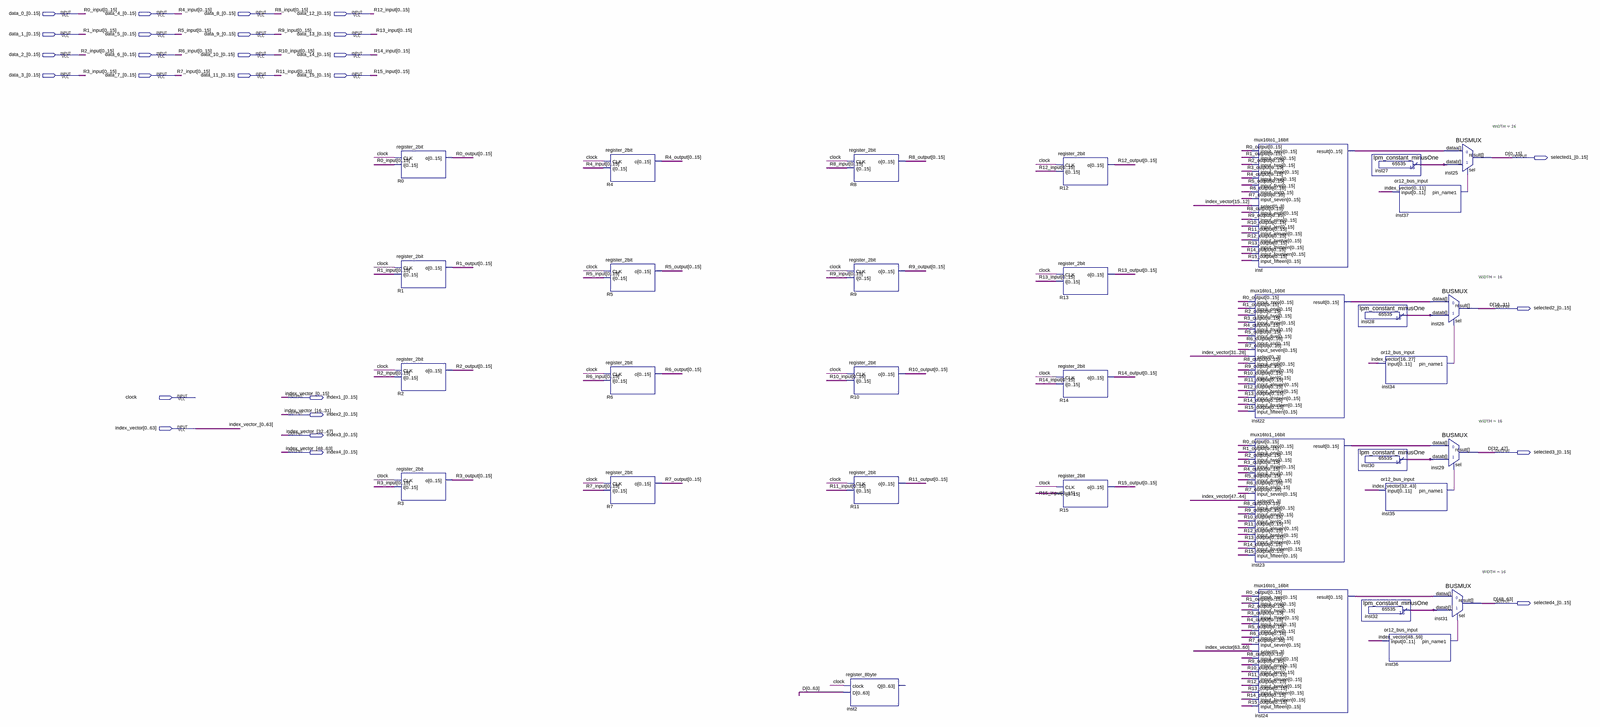
[diagram p0: schematic sheet, whole]
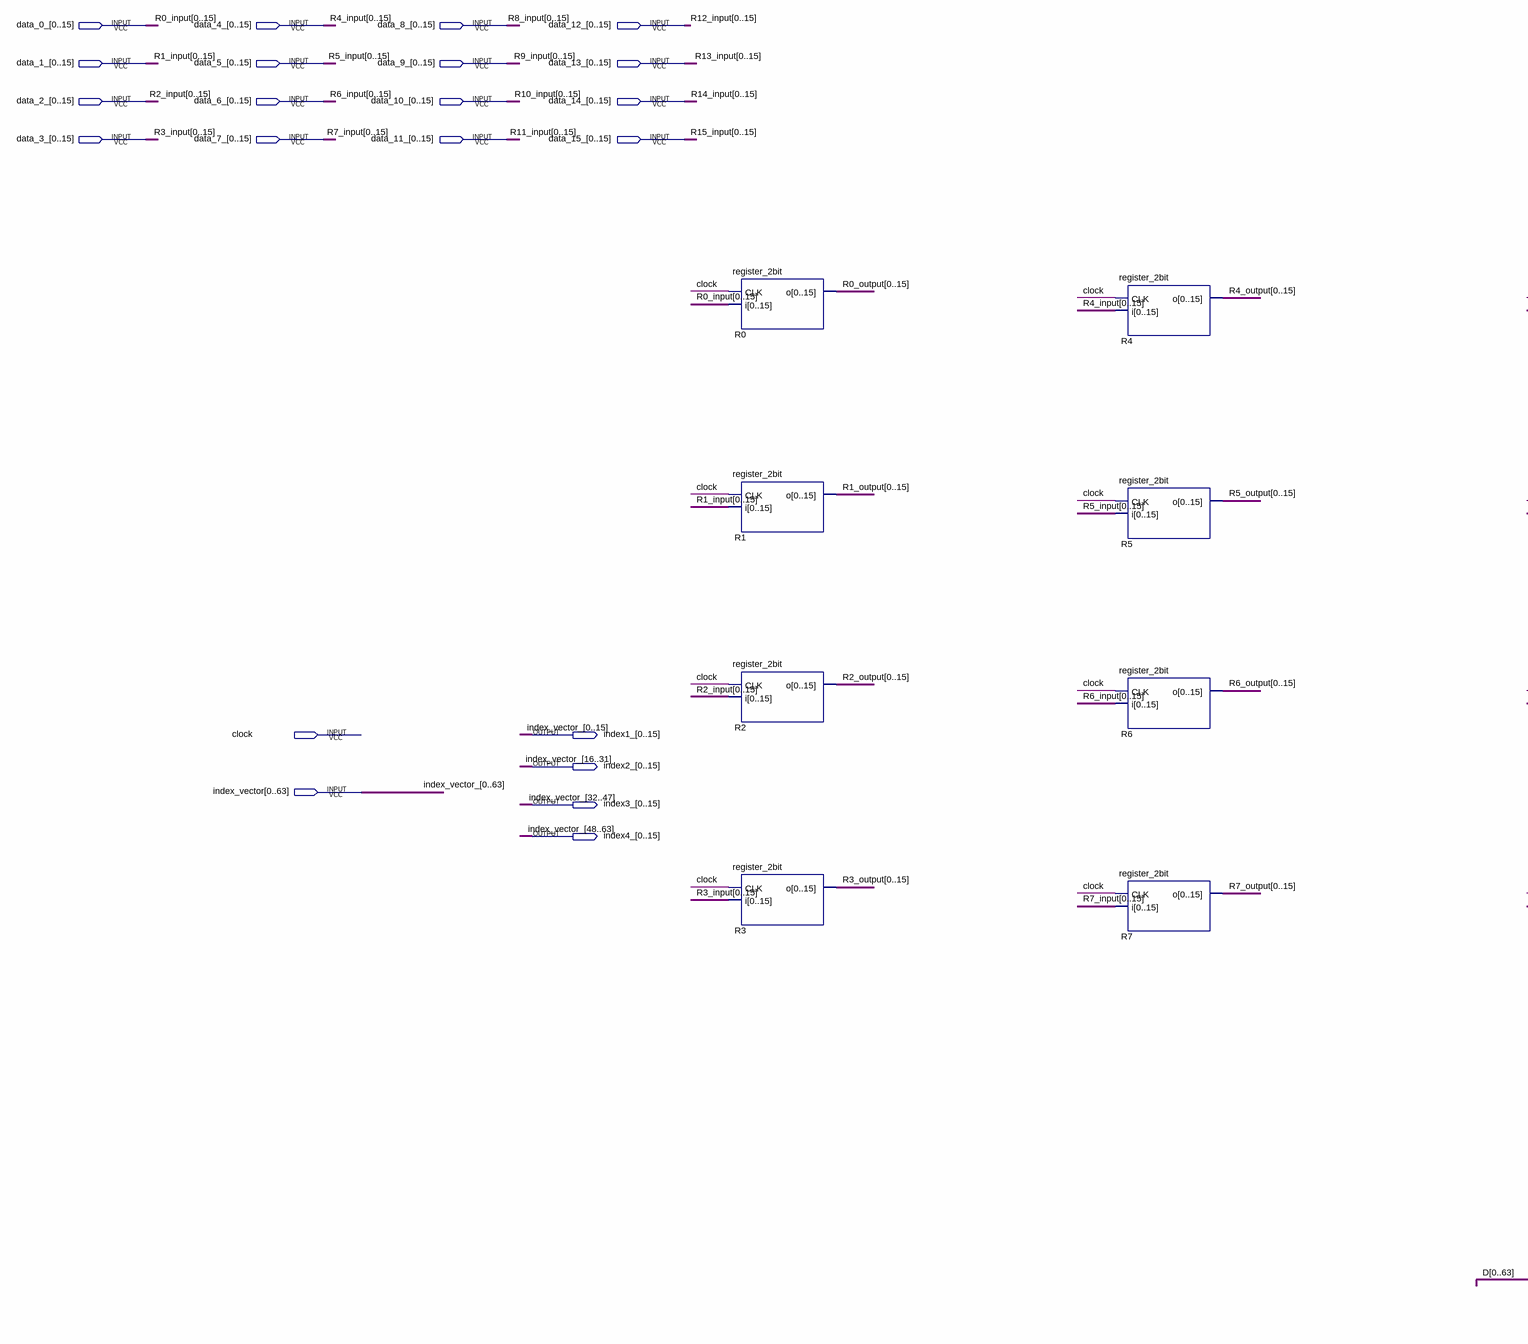
[diagram p1: schematic sheet, left part]
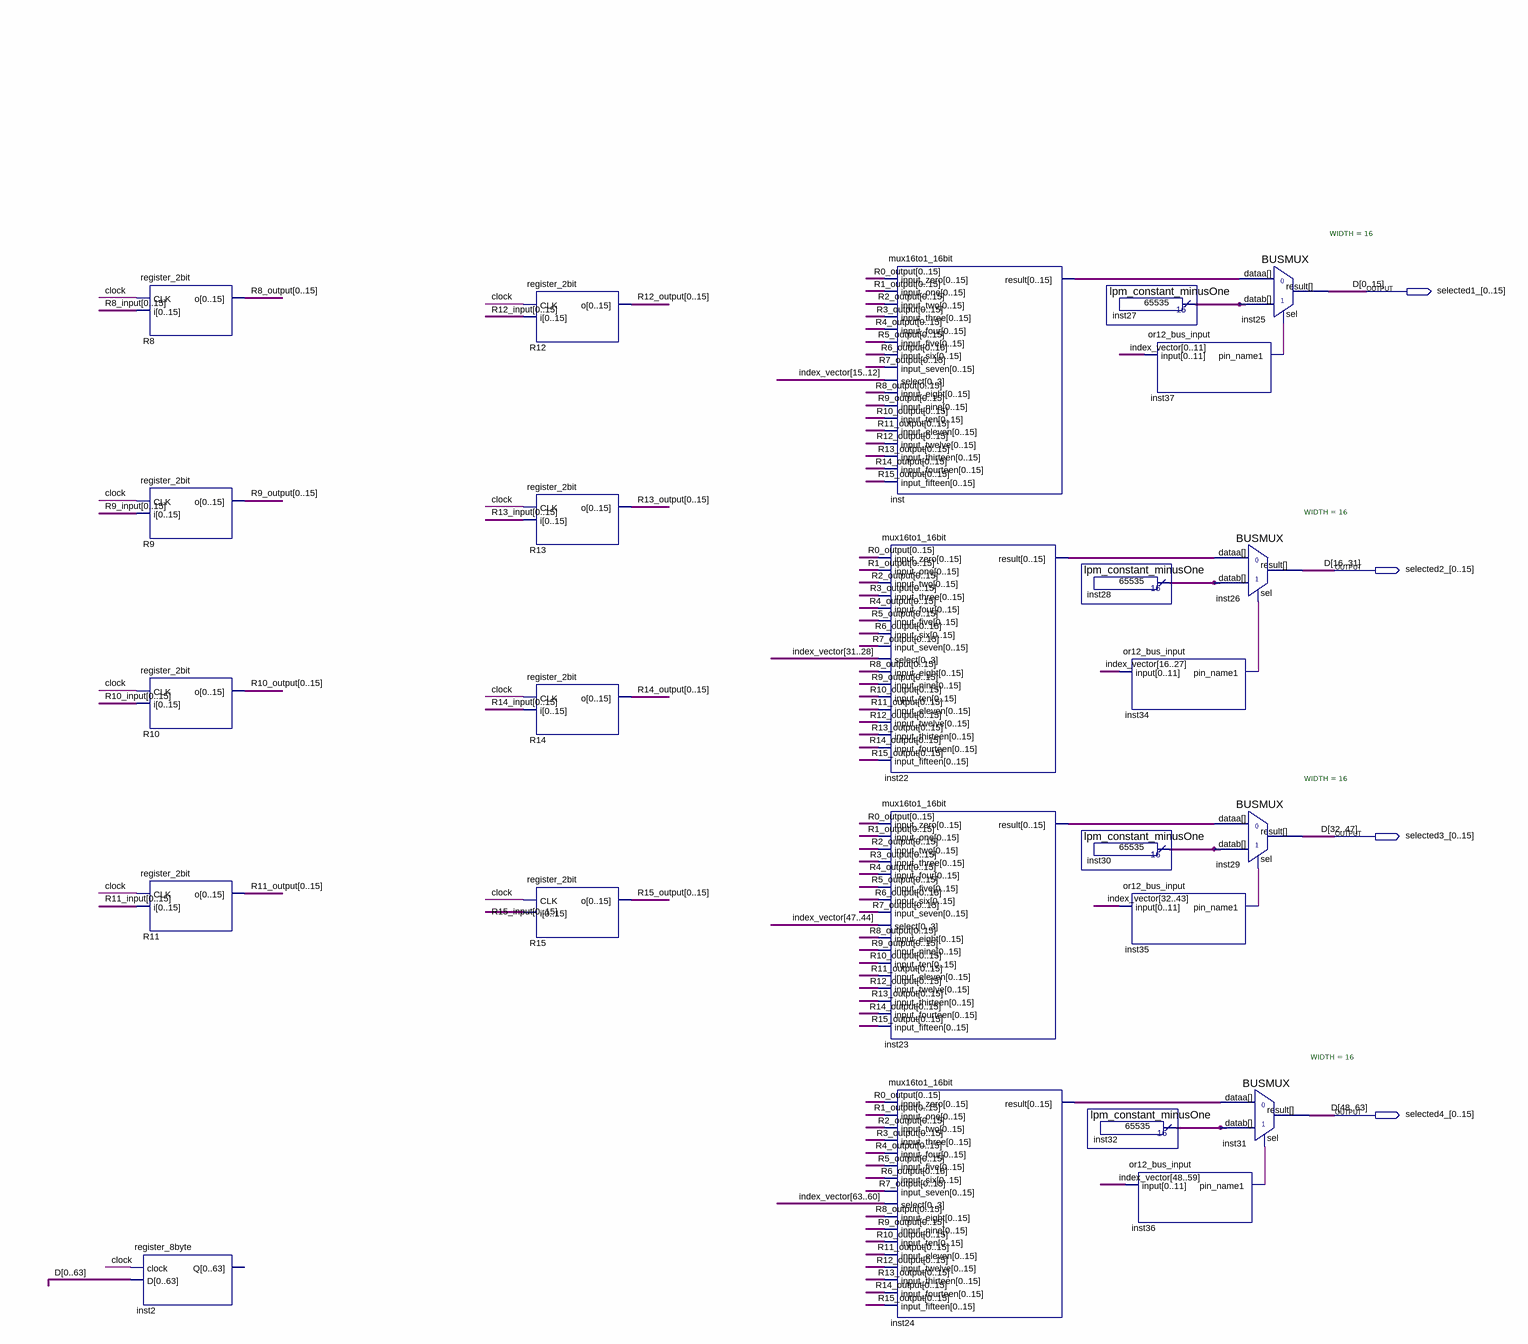
[diagram p2: schematic sheet, right part]
// Quartus schematic gather.bdf as structural Verilog: 33 symbols, 26 pins
module gather (
  input  [0:15] data_0_,
  input  [0:15] data_4_,
  input  [0:15] data_8_,
  input  [0:15] data_12_,
  input  [0:15] data_1_,
  input  [0:15] data_5_,
  input  [0:15] data_9_,
  input  [0:15] data_13_,
  input  [0:15] data_2_,
  input  [0:15] data_6_,
  input  [0:15] data_10_,
  input  [0:15] data_14_,
  input  [0:15] data_3_,
  input  [0:15] data_7_,
  input  [0:15] data_11_,
  input  [0:15] data_15_,
  input  clock,
  input  [0:63] index_vector,
  output [0:15] selected1_,
  output [0:15] selected2_,
  output [0:15] index1_,
  output [0:15] index2_,
  output [0:15] index3_,
  output [0:15] index4_,
  output [0:15] selected3_,
  output [0:15] selected4_
);

  wire inst34_pin_name1, inst35_pin_name1, inst36_pin_name1, inst37_pin_name1;
  wire [15:0] inst22_result, inst23_result, inst24_result, inst27_result, inst28_result, inst30_result,
       inst32_result, inst_result, R0_output, R1_output, R2_output, R3_output, R4_output, R5_output,
       R6_output, R7_output, R8_output, R9_output, R10_output, R11_output, R12_output, R13_output,
       R14_output, R15_output;

  register_2bit R0 (
    .CLK(clock), .i(data_0_),
    .o({R0_output[0], R0_output[1], R0_output[2], R0_output[3], R0_output[4], R0_output[5], R0_output[6], R0_output[7], R0_output[8], R0_output[9], R0_output[10], R0_output[11], R0_output[12], R0_output[13], R0_output[14], R0_output[15]}));
  register_2bit R1 (
    .CLK(clock), .i(data_1_),
    .o({R1_output[0], R1_output[1], R1_output[2], R1_output[3], R1_output[4], R1_output[5], R1_output[6], R1_output[7], R1_output[8], R1_output[9], R1_output[10], R1_output[11], R1_output[12], R1_output[13], R1_output[14], R1_output[15]}));
  register_2bit R2 (
    .CLK(clock), .i(data_2_),
    .o({R2_output[0], R2_output[1], R2_output[2], R2_output[3], R2_output[4], R2_output[5], R2_output[6], R2_output[7], R2_output[8], R2_output[9], R2_output[10], R2_output[11], R2_output[12], R2_output[13], R2_output[14], R2_output[15]}));
  register_2bit R3 (
    .CLK(clock), .i(data_3_),
    .o({R3_output[0], R3_output[1], R3_output[2], R3_output[3], R3_output[4], R3_output[5], R3_output[6], R3_output[7], R3_output[8], R3_output[9], R3_output[10], R3_output[11], R3_output[12], R3_output[13], R3_output[14], R3_output[15]}));
  register_2bit R4 (
    .CLK(clock), .i(data_4_),
    .o({R4_output[0], R4_output[1], R4_output[2], R4_output[3], R4_output[4], R4_output[5], R4_output[6], R4_output[7], R4_output[8], R4_output[9], R4_output[10], R4_output[11], R4_output[12], R4_output[13], R4_output[14], R4_output[15]}));
  register_2bit R5 (
    .CLK(clock), .i(data_5_),
    .o({R5_output[0], R5_output[1], R5_output[2], R5_output[3], R5_output[4], R5_output[5], R5_output[6], R5_output[7], R5_output[8], R5_output[9], R5_output[10], R5_output[11], R5_output[12], R5_output[13], R5_output[14], R5_output[15]}));
  register_2bit R6 (
    .CLK(clock), .i(data_6_),
    .o({R6_output[0], R6_output[1], R6_output[2], R6_output[3], R6_output[4], R6_output[5], R6_output[6], R6_output[7], R6_output[8], R6_output[9], R6_output[10], R6_output[11], R6_output[12], R6_output[13], R6_output[14], R6_output[15]}));
  register_2bit R7 (
    .CLK(clock), .i(data_7_),
    .o({R7_output[0], R7_output[1], R7_output[2], R7_output[3], R7_output[4], R7_output[5], R7_output[6], R7_output[7], R7_output[8], R7_output[9], R7_output[10], R7_output[11], R7_output[12], R7_output[13], R7_output[14], R7_output[15]}));
  register_2bit R8 (
    .CLK(clock), .i(data_8_),
    .o({R8_output[0], R8_output[1], R8_output[2], R8_output[3], R8_output[4], R8_output[5], R8_output[6], R8_output[7], R8_output[8], R8_output[9], R8_output[10], R8_output[11], R8_output[12], R8_output[13], R8_output[14], R8_output[15]}));
  register_2bit R9 (
    .CLK(clock), .i(data_9_),
    .o({R9_output[0], R9_output[1], R9_output[2], R9_output[3], R9_output[4], R9_output[5], R9_output[6], R9_output[7], R9_output[8], R9_output[9], R9_output[10], R9_output[11], R9_output[12], R9_output[13], R9_output[14], R9_output[15]}));
  register_2bit R10 (
    .CLK(clock), .i(data_10_),
    .o({R10_output[0], R10_output[1], R10_output[2], R10_output[3], R10_output[4], R10_output[5], R10_output[6], R10_output[7], R10_output[8], R10_output[9], R10_output[10], R10_output[11], R10_output[12], R10_output[13], R10_output[14], R10_output[15]}));
  register_2bit R11 (
    .CLK(clock), .i(data_11_),
    .o({R11_output[0], R11_output[1], R11_output[2], R11_output[3], R11_output[4], R11_output[5], R11_output[6], R11_output[7], R11_output[8], R11_output[9], R11_output[10], R11_output[11], R11_output[12], R11_output[13], R11_output[14], R11_output[15]}));
  register_8byte inst2 (.clock(clock), .D({selected1_, selected2_, selected3_, selected4_}));  // open: Q
  register_2bit R12 (
    .CLK(clock), .i(data_12_),
    .o({R12_output[0], R12_output[1], R12_output[2], R12_output[3], R12_output[4], R12_output[5], R12_output[6], R12_output[7], R12_output[8], R12_output[9], R12_output[10], R12_output[11], R12_output[12], R12_output[13], R12_output[14], R12_output[15]}));
  register_2bit R13 (
    .CLK(clock), .i(data_13_),
    .o({R13_output[0], R13_output[1], R13_output[2], R13_output[3], R13_output[4], R13_output[5], R13_output[6], R13_output[7], R13_output[8], R13_output[9], R13_output[10], R13_output[11], R13_output[12], R13_output[13], R13_output[14], R13_output[15]}));
  register_2bit R14 (
    .CLK(clock), .i(data_14_),
    .o({R14_output[0], R14_output[1], R14_output[2], R14_output[3], R14_output[4], R14_output[5], R14_output[6], R14_output[7], R14_output[8], R14_output[9], R14_output[10], R14_output[11], R14_output[12], R14_output[13], R14_output[14], R14_output[15]}));
  register_2bit R15 (
    .CLK(clock), .i(data_15_),
    .o({R15_output[0], R15_output[1], R15_output[2], R15_output[3], R15_output[4], R15_output[5], R15_output[6], R15_output[7], R15_output[8], R15_output[9], R15_output[10], R15_output[11], R15_output[12], R15_output[13], R15_output[14], R15_output[15]}));
  mux16to1_16bit inst (
    .input_zero({R0_output[0], R0_output[1], R0_output[2], R0_output[3], R0_output[4], R0_output[5], R0_output[6], R0_output[7], R0_output[8], R0_output[9], R0_output[10], R0_output[11], R0_output[12], R0_output[13], R0_output[14], R0_output[15]}),
    .input_one({R1_output[0], R1_output[1], R1_output[2], R1_output[3], R1_output[4], R1_output[5], R1_output[6], R1_output[7], R1_output[8], R1_output[9], R1_output[10], R1_output[11], R1_output[12], R1_output[13], R1_output[14], R1_output[15]}),
    .input_two({R2_output[0], R2_output[1], R2_output[2], R2_output[3], R2_output[4], R2_output[5], R2_output[6], R2_output[7], R2_output[8], R2_output[9], R2_output[10], R2_output[11], R2_output[12], R2_output[13], R2_output[14], R2_output[15]}),
    .input_three({R3_output[0], R3_output[1], R3_output[2], R3_output[3], R3_output[4], R3_output[5], R3_output[6], R3_output[7], R3_output[8], R3_output[9], R3_output[10], R3_output[11], R3_output[12], R3_output[13], R3_output[14], R3_output[15]}),
    .input_four({R4_output[0], R4_output[1], R4_output[2], R4_output[3], R4_output[4], R4_output[5], R4_output[6], R4_output[7], R4_output[8], R4_output[9], R4_output[10], R4_output[11], R4_output[12], R4_output[13], R4_output[14], R4_output[15]}),
    .input_five({R5_output[0], R5_output[1], R5_output[2], R5_output[3], R5_output[4], R5_output[5], R5_output[6], R5_output[7], R5_output[8], R5_output[9], R5_output[10], R5_output[11], R5_output[12], R5_output[13], R5_output[14], R5_output[15]}),
    .input_six({R6_output[0], R6_output[1], R6_output[2], R6_output[3], R6_output[4], R6_output[5], R6_output[6], R6_output[7], R6_output[8], R6_output[9], R6_output[10], R6_output[11], R6_output[12], R6_output[13], R6_output[14], R6_output[15]}),
    .input_seven({R7_output[0], R7_output[1], R7_output[2], R7_output[3], R7_output[4], R7_output[5], R7_output[6], R7_output[7], R7_output[8], R7_output[9], R7_output[10], R7_output[11], R7_output[12], R7_output[13], R7_output[14], R7_output[15]}),
    .select({index_vector[15], index_vector[14], index_vector[13], index_vector[12]}),
    .input_eight({R8_output[0], R8_output[1], R8_output[2], R8_output[3], R8_output[4], R8_output[5], R8_output[6], R8_output[7], R8_output[8], R8_output[9], R8_output[10], R8_output[11], R8_output[12], R8_output[13], R8_output[14], R8_output[15]}),
    .input_nine({R9_output[0], R9_output[1], R9_output[2], R9_output[3], R9_output[4], R9_output[5], R9_output[6], R9_output[7], R9_output[8], R9_output[9], R9_output[10], R9_output[11], R9_output[12], R9_output[13], R9_output[14], R9_output[15]}),
    .input_ten({R10_output[0], R10_output[1], R10_output[2], R10_output[3], R10_output[4], R10_output[5], R10_output[6], R10_output[7], R10_output[8], R10_output[9], R10_output[10], R10_output[11], R10_output[12], R10_output[13], R10_output[14], R10_output[15]}),
    .input_eleven({R11_output[0], R11_output[1], R11_output[2], R11_output[3], R11_output[4], R11_output[5], R11_output[6], R11_output[7], R11_output[8], R11_output[9], R11_output[10], R11_output[11], R11_output[12], R11_output[13], R11_output[14], R11_output[15]}),
    .input_twelve({R12_output[0], R12_output[1], R12_output[2], R12_output[3], R12_output[4], R12_output[5], R12_output[6], R12_output[7], R12_output[8], R12_output[9], R12_output[10], R12_output[11], R12_output[12], R12_output[13], R12_output[14], R12_output[15]}),
    .input_thirteen({R13_output[0], R13_output[1], R13_output[2], R13_output[3], R13_output[4], R13_output[5], R13_output[6], R13_output[7], R13_output[8], R13_output[9], R13_output[10], R13_output[11], R13_output[12], R13_output[13], R13_output[14], R13_output[15]}),
    .input_fourteen({R14_output[0], R14_output[1], R14_output[2], R14_output[3], R14_output[4], R14_output[5], R14_output[6], R14_output[7], R14_output[8], R14_output[9], R14_output[10], R14_output[11], R14_output[12], R14_output[13], R14_output[14], R14_output[15]}),
    .input_fifteen({R15_output[0], R15_output[1], R15_output[2], R15_output[3], R15_output[4], R15_output[5], R15_output[6], R15_output[7], R15_output[8], R15_output[9], R15_output[10], R15_output[11], R15_output[12], R15_output[13], R15_output[14], R15_output[15]}),
    .result(inst_result));
  mux16to1_16bit inst22 (
    .input_zero({R0_output[0], R0_output[1], R0_output[2], R0_output[3], R0_output[4], R0_output[5], R0_output[6], R0_output[7], R0_output[8], R0_output[9], R0_output[10], R0_output[11], R0_output[12], R0_output[13], R0_output[14], R0_output[15]}),
    .input_one({R1_output[0], R1_output[1], R1_output[2], R1_output[3], R1_output[4], R1_output[5], R1_output[6], R1_output[7], R1_output[8], R1_output[9], R1_output[10], R1_output[11], R1_output[12], R1_output[13], R1_output[14], R1_output[15]}),
    .input_two({R2_output[0], R2_output[1], R2_output[2], R2_output[3], R2_output[4], R2_output[5], R2_output[6], R2_output[7], R2_output[8], R2_output[9], R2_output[10], R2_output[11], R2_output[12], R2_output[13], R2_output[14], R2_output[15]}),
    .input_three({R3_output[0], R3_output[1], R3_output[2], R3_output[3], R3_output[4], R3_output[5], R3_output[6], R3_output[7], R3_output[8], R3_output[9], R3_output[10], R3_output[11], R3_output[12], R3_output[13], R3_output[14], R3_output[15]}),
    .input_four({R4_output[0], R4_output[1], R4_output[2], R4_output[3], R4_output[4], R4_output[5], R4_output[6], R4_output[7], R4_output[8], R4_output[9], R4_output[10], R4_output[11], R4_output[12], R4_output[13], R4_output[14], R4_output[15]}),
    .input_five({R5_output[0], R5_output[1], R5_output[2], R5_output[3], R5_output[4], R5_output[5], R5_output[6], R5_output[7], R5_output[8], R5_output[9], R5_output[10], R5_output[11], R5_output[12], R5_output[13], R5_output[14], R5_output[15]}),
    .input_six({R6_output[0], R6_output[1], R6_output[2], R6_output[3], R6_output[4], R6_output[5], R6_output[6], R6_output[7], R6_output[8], R6_output[9], R6_output[10], R6_output[11], R6_output[12], R6_output[13], R6_output[14], R6_output[15]}),
    .input_seven({R7_output[0], R7_output[1], R7_output[2], R7_output[3], R7_output[4], R7_output[5], R7_output[6], R7_output[7], R7_output[8], R7_output[9], R7_output[10], R7_output[11], R7_output[12], R7_output[13], R7_output[14], R7_output[15]}),
    .select({index_vector[31], index_vector[30], index_vector[29], index_vector[28]}),
    .input_eight({R8_output[0], R8_output[1], R8_output[2], R8_output[3], R8_output[4], R8_output[5], R8_output[6], R8_output[7], R8_output[8], R8_output[9], R8_output[10], R8_output[11], R8_output[12], R8_output[13], R8_output[14], R8_output[15]}),
    .input_nine({R9_output[0], R9_output[1], R9_output[2], R9_output[3], R9_output[4], R9_output[5], R9_output[6], R9_output[7], R9_output[8], R9_output[9], R9_output[10], R9_output[11], R9_output[12], R9_output[13], R9_output[14], R9_output[15]}),
    .input_ten({R10_output[0], R10_output[1], R10_output[2], R10_output[3], R10_output[4], R10_output[5], R10_output[6], R10_output[7], R10_output[8], R10_output[9], R10_output[10], R10_output[11], R10_output[12], R10_output[13], R10_output[14], R10_output[15]}),
    .input_eleven({R11_output[0], R11_output[1], R11_output[2], R11_output[3], R11_output[4], R11_output[5], R11_output[6], R11_output[7], R11_output[8], R11_output[9], R11_output[10], R11_output[11], R11_output[12], R11_output[13], R11_output[14], R11_output[15]}),
    .input_twelve({R12_output[0], R12_output[1], R12_output[2], R12_output[3], R12_output[4], R12_output[5], R12_output[6], R12_output[7], R12_output[8], R12_output[9], R12_output[10], R12_output[11], R12_output[12], R12_output[13], R12_output[14], R12_output[15]}),
    .input_thirteen({R13_output[0], R13_output[1], R13_output[2], R13_output[3], R13_output[4], R13_output[5], R13_output[6], R13_output[7], R13_output[8], R13_output[9], R13_output[10], R13_output[11], R13_output[12], R13_output[13], R13_output[14], R13_output[15]}),
    .input_fourteen({R14_output[0], R14_output[1], R14_output[2], R14_output[3], R14_output[4], R14_output[5], R14_output[6], R14_output[7], R14_output[8], R14_output[9], R14_output[10], R14_output[11], R14_output[12], R14_output[13], R14_output[14], R14_output[15]}),
    .input_fifteen({R15_output[0], R15_output[1], R15_output[2], R15_output[3], R15_output[4], R15_output[5], R15_output[6], R15_output[7], R15_output[8], R15_output[9], R15_output[10], R15_output[11], R15_output[12], R15_output[13], R15_output[14], R15_output[15]}),
    .result(inst22_result));
  mux16to1_16bit inst23 (
    .input_zero({R0_output[0], R0_output[1], R0_output[2], R0_output[3], R0_output[4], R0_output[5], R0_output[6], R0_output[7], R0_output[8], R0_output[9], R0_output[10], R0_output[11], R0_output[12], R0_output[13], R0_output[14], R0_output[15]}),
    .input_one({R1_output[0], R1_output[1], R1_output[2], R1_output[3], R1_output[4], R1_output[5], R1_output[6], R1_output[7], R1_output[8], R1_output[9], R1_output[10], R1_output[11], R1_output[12], R1_output[13], R1_output[14], R1_output[15]}),
    .input_two({R2_output[0], R2_output[1], R2_output[2], R2_output[3], R2_output[4], R2_output[5], R2_output[6], R2_output[7], R2_output[8], R2_output[9], R2_output[10], R2_output[11], R2_output[12], R2_output[13], R2_output[14], R2_output[15]}),
    .input_three({R3_output[0], R3_output[1], R3_output[2], R3_output[3], R3_output[4], R3_output[5], R3_output[6], R3_output[7], R3_output[8], R3_output[9], R3_output[10], R3_output[11], R3_output[12], R3_output[13], R3_output[14], R3_output[15]}),
    .input_four({R4_output[0], R4_output[1], R4_output[2], R4_output[3], R4_output[4], R4_output[5], R4_output[6], R4_output[7], R4_output[8], R4_output[9], R4_output[10], R4_output[11], R4_output[12], R4_output[13], R4_output[14], R4_output[15]}),
    .input_five({R5_output[0], R5_output[1], R5_output[2], R5_output[3], R5_output[4], R5_output[5], R5_output[6], R5_output[7], R5_output[8], R5_output[9], R5_output[10], R5_output[11], R5_output[12], R5_output[13], R5_output[14], R5_output[15]}),
    .input_six({R6_output[0], R6_output[1], R6_output[2], R6_output[3], R6_output[4], R6_output[5], R6_output[6], R6_output[7], R6_output[8], R6_output[9], R6_output[10], R6_output[11], R6_output[12], R6_output[13], R6_output[14], R6_output[15]}),
    .input_seven({R7_output[0], R7_output[1], R7_output[2], R7_output[3], R7_output[4], R7_output[5], R7_output[6], R7_output[7], R7_output[8], R7_output[9], R7_output[10], R7_output[11], R7_output[12], R7_output[13], R7_output[14], R7_output[15]}),
    .select({index_vector[47], index_vector[46], index_vector[45], index_vector[44]}),
    .input_eight({R8_output[0], R8_output[1], R8_output[2], R8_output[3], R8_output[4], R8_output[5], R8_output[6], R8_output[7], R8_output[8], R8_output[9], R8_output[10], R8_output[11], R8_output[12], R8_output[13], R8_output[14], R8_output[15]}),
    .input_nine({R9_output[0], R9_output[1], R9_output[2], R9_output[3], R9_output[4], R9_output[5], R9_output[6], R9_output[7], R9_output[8], R9_output[9], R9_output[10], R9_output[11], R9_output[12], R9_output[13], R9_output[14], R9_output[15]}),
    .input_ten({R10_output[0], R10_output[1], R10_output[2], R10_output[3], R10_output[4], R10_output[5], R10_output[6], R10_output[7], R10_output[8], R10_output[9], R10_output[10], R10_output[11], R10_output[12], R10_output[13], R10_output[14], R10_output[15]}),
    .input_eleven({R11_output[0], R11_output[1], R11_output[2], R11_output[3], R11_output[4], R11_output[5], R11_output[6], R11_output[7], R11_output[8], R11_output[9], R11_output[10], R11_output[11], R11_output[12], R11_output[13], R11_output[14], R11_output[15]}),
    .input_twelve({R12_output[0], R12_output[1], R12_output[2], R12_output[3], R12_output[4], R12_output[5], R12_output[6], R12_output[7], R12_output[8], R12_output[9], R12_output[10], R12_output[11], R12_output[12], R12_output[13], R12_output[14], R12_output[15]}),
    .input_thirteen({R13_output[0], R13_output[1], R13_output[2], R13_output[3], R13_output[4], R13_output[5], R13_output[6], R13_output[7], R13_output[8], R13_output[9], R13_output[10], R13_output[11], R13_output[12], R13_output[13], R13_output[14], R13_output[15]}),
    .input_fourteen({R14_output[0], R14_output[1], R14_output[2], R14_output[3], R14_output[4], R14_output[5], R14_output[6], R14_output[7], R14_output[8], R14_output[9], R14_output[10], R14_output[11], R14_output[12], R14_output[13], R14_output[14], R14_output[15]}),
    .input_fifteen({R15_output[0], R15_output[1], R15_output[2], R15_output[3], R15_output[4], R15_output[5], R15_output[6], R15_output[7], R15_output[8], R15_output[9], R15_output[10], R15_output[11], R15_output[12], R15_output[13], R15_output[14], R15_output[15]}),
    .result(inst23_result));
  mux16to1_16bit inst24 (
    .input_zero({R0_output[0], R0_output[1], R0_output[2], R0_output[3], R0_output[4], R0_output[5], R0_output[6], R0_output[7], R0_output[8], R0_output[9], R0_output[10], R0_output[11], R0_output[12], R0_output[13], R0_output[14], R0_output[15]}),
    .input_one({R1_output[0], R1_output[1], R1_output[2], R1_output[3], R1_output[4], R1_output[5], R1_output[6], R1_output[7], R1_output[8], R1_output[9], R1_output[10], R1_output[11], R1_output[12], R1_output[13], R1_output[14], R1_output[15]}),
    .input_two({R2_output[0], R2_output[1], R2_output[2], R2_output[3], R2_output[4], R2_output[5], R2_output[6], R2_output[7], R2_output[8], R2_output[9], R2_output[10], R2_output[11], R2_output[12], R2_output[13], R2_output[14], R2_output[15]}),
    .input_three({R3_output[0], R3_output[1], R3_output[2], R3_output[3], R3_output[4], R3_output[5], R3_output[6], R3_output[7], R3_output[8], R3_output[9], R3_output[10], R3_output[11], R3_output[12], R3_output[13], R3_output[14], R3_output[15]}),
    .input_four({R4_output[0], R4_output[1], R4_output[2], R4_output[3], R4_output[4], R4_output[5], R4_output[6], R4_output[7], R4_output[8], R4_output[9], R4_output[10], R4_output[11], R4_output[12], R4_output[13], R4_output[14], R4_output[15]}),
    .input_five({R5_output[0], R5_output[1], R5_output[2], R5_output[3], R5_output[4], R5_output[5], R5_output[6], R5_output[7], R5_output[8], R5_output[9], R5_output[10], R5_output[11], R5_output[12], R5_output[13], R5_output[14], R5_output[15]}),
    .input_six({R6_output[0], R6_output[1], R6_output[2], R6_output[3], R6_output[4], R6_output[5], R6_output[6], R6_output[7], R6_output[8], R6_output[9], R6_output[10], R6_output[11], R6_output[12], R6_output[13], R6_output[14], R6_output[15]}),
    .input_seven({R7_output[0], R7_output[1], R7_output[2], R7_output[3], R7_output[4], R7_output[5], R7_output[6], R7_output[7], R7_output[8], R7_output[9], R7_output[10], R7_output[11], R7_output[12], R7_output[13], R7_output[14], R7_output[15]}),
    .select({index_vector[63], index_vector[62], index_vector[61], index_vector[60]}),
    .input_eight({R8_output[0], R8_output[1], R8_output[2], R8_output[3], R8_output[4], R8_output[5], R8_output[6], R8_output[7], R8_output[8], R8_output[9], R8_output[10], R8_output[11], R8_output[12], R8_output[13], R8_output[14], R8_output[15]}),
    .input_nine({R9_output[0], R9_output[1], R9_output[2], R9_output[3], R9_output[4], R9_output[5], R9_output[6], R9_output[7], R9_output[8], R9_output[9], R9_output[10], R9_output[11], R9_output[12], R9_output[13], R9_output[14], R9_output[15]}),
    .input_ten({R10_output[0], R10_output[1], R10_output[2], R10_output[3], R10_output[4], R10_output[5], R10_output[6], R10_output[7], R10_output[8], R10_output[9], R10_output[10], R10_output[11], R10_output[12], R10_output[13], R10_output[14], R10_output[15]}),
    .input_eleven({R11_output[0], R11_output[1], R11_output[2], R11_output[3], R11_output[4], R11_output[5], R11_output[6], R11_output[7], R11_output[8], R11_output[9], R11_output[10], R11_output[11], R11_output[12], R11_output[13], R11_output[14], R11_output[15]}),
    .input_twelve({R12_output[0], R12_output[1], R12_output[2], R12_output[3], R12_output[4], R12_output[5], R12_output[6], R12_output[7], R12_output[8], R12_output[9], R12_output[10], R12_output[11], R12_output[12], R12_output[13], R12_output[14], R12_output[15]}),
    .input_thirteen({R13_output[0], R13_output[1], R13_output[2], R13_output[3], R13_output[4], R13_output[5], R13_output[6], R13_output[7], R13_output[8], R13_output[9], R13_output[10], R13_output[11], R13_output[12], R13_output[13], R13_output[14], R13_output[15]}),
    .input_fourteen({R14_output[0], R14_output[1], R14_output[2], R14_output[3], R14_output[4], R14_output[5], R14_output[6], R14_output[7], R14_output[8], R14_output[9], R14_output[10], R14_output[11], R14_output[12], R14_output[13], R14_output[14], R14_output[15]}),
    .input_fifteen({R15_output[0], R15_output[1], R15_output[2], R15_output[3], R15_output[4], R15_output[5], R15_output[6], R15_output[7], R15_output[8], R15_output[9], R15_output[10], R15_output[11], R15_output[12], R15_output[13], R15_output[14], R15_output[15]}),
    .result(inst24_result));
  lpm_constant_minusOne inst27 (.result(inst27_result));
  lpm_constant_minusOne inst28 (.result(inst28_result));
  lpm_constant_minusOne inst30 (.result(inst30_result));
  lpm_constant_minusOne inst32 (.result(inst32_result));
  or12_bus_input inst37 (.\input (index_vector[0:11]), .pin_name1(inst37_pin_name1));
  or12_bus_input inst34 (.\input (index_vector[16:27]), .pin_name1(inst34_pin_name1));
  or12_bus_input inst35 (.\input (index_vector[32:43]), .pin_name1(inst35_pin_name1));
  or12_bus_input inst36 (.\input (index_vector[48:59]), .pin_name1(inst36_pin_name1));
  BUSMUX #(.WIDTH(16)) inst26 (
    .datab(inst28_result), .sel(inst34_pin_name1), .dataa(inst22_result), .result(selected2_));
  BUSMUX #(.WIDTH(16)) inst29 (
    .datab(inst30_result), .sel(inst35_pin_name1), .dataa(inst23_result), .result(selected3_));
  BUSMUX #(.WIDTH(16)) inst25 (.datab(inst27_result), .sel(inst37_pin_name1), .dataa(inst_result), .result(selected1_));
  BUSMUX #(.WIDTH(16)) inst31 (
    .datab(inst32_result), .sel(inst36_pin_name1), .dataa(inst24_result), .result(selected4_));

  assign index1_ = index_vector[0:15];
  assign index2_ = index_vector[16:31];
  assign index3_ = index_vector[32:47];
  assign index4_ = index_vector[48:63];

  // Other names for the same wires on the sheet: D[63:0] = {selected4_[15], selected4_[14], selected4_[13], selected4_[12], selected4_[11], selected4_[10], selected4_[9], selected4_[8], selected4_[7], selected4_[6], selected4_[5], selected4_[4], selected4_[3], selected4_[2], selected4_[1], selected4_[0], selected3_[15], selected3_[14], selected3_[13], selected3_[12], selected3_[11], selected3_[10], selected3_[9], selected3_[8], selected3_[7], selected3_[6], selected3_[5], selected3_[4], selected3_[3], selected3_[2], selected3_[1], selected3_[0], selected2_[15], selected2_[14], selected2_[13], selected2_[12], selected2_[11], selected2_[10], selected2_[9], selected2_[8], selected2_[7], selected2_[6], selected2_[5], selected2_[4], selected2_[3], selected2_[2], selected2_[1], selected2_[0], selected1_[15], selected1_[14], selected1_[13], selected1_[12], selected1_[11], selected1_[10], selected1_[9], selected1_[8], selected1_[7], selected1_[6], selected1_[5], selected1_[4], selected1_[3], selected1_[2], selected1_[1], selected1_[0]};
  //   index_vector_[63:0] = {index_vector[63], index_vector[62], index_vector[61], index_vector[60], index_vector[59], index_vector[58], index_vector[57], index_vector[56], index_vector[55], index_vector[54], index_vector[53], index_vector[52], index_vector[51], index_vector[50], index_vector[49], index_vector[48], index_vector[47], index_vector[46], index_vector[45], index_vector[44], index_vector[43], index_vector[42], index_vector[41], index_vector[40], index_vector[39], index_vector[38], index_vector[37], index_vector[36], index_vector[35], index_vector[34], index_vector[33], index_vector[32], index_vector[31], index_vector[30], index_vector[29], index_vector[28], index_vector[27], index_vector[26], index_vector[25], index_vector[24], index_vector[23], index_vector[22], index_vector[21], index_vector[20], index_vector[19], index_vector[18], index_vector[17], index_vector[16], index_vector[15], index_vector[14], index_vector[13], index_vector[12], index_vector[11], index_vector[10], index_vector[9], index_vector[8], index_vector[7], index_vector[6], index_vector[5], index_vector[4], index_vector[3], index_vector[2], index_vector[1], index_vector[0]};
  //   R0_input[15:0] = {data_0_[15], data_0_[14], data_0_[13], data_0_[12], data_0_[11], data_0_[10], data_0_[9], data_0_[8], data_0_[7], data_0_[6], data_0_[5], data_0_[4], data_0_[3], data_0_[2], data_0_[1], data_0_[0]};
  //   R1_input[15:0] = {data_1_[15], data_1_[14], data_1_[13], data_1_[12], data_1_[11], data_1_[10], data_1_[9], data_1_[8], data_1_[7], data_1_[6], data_1_[5], data_1_[4], data_1_[3], data_1_[2], data_1_[1], data_1_[0]};
  //   R2_input[15:0] = {data_2_[15], data_2_[14], data_2_[13], data_2_[12], data_2_[11], data_2_[10], data_2_[9], data_2_[8], data_2_[7], data_2_[6], data_2_[5], data_2_[4], data_2_[3], data_2_[2], data_2_[1], data_2_[0]};
  //   R3_input[15:0] = {data_3_[15], data_3_[14], data_3_[13], data_3_[12], data_3_[11], data_3_[10], data_3_[9], data_3_[8], data_3_[7], data_3_[6], data_3_[5], data_3_[4], data_3_[3], data_3_[2], data_3_[1], data_3_[0]};
  //   R4_input[15:0] = {data_4_[15], data_4_[14], data_4_[13], data_4_[12], data_4_[11], data_4_[10], data_4_[9], data_4_[8], data_4_[7], data_4_[6], data_4_[5], data_4_[4], data_4_[3], data_4_[2], data_4_[1], data_4_[0]};
  //   R5_input[15:0] = {data_5_[15], data_5_[14], data_5_[13], data_5_[12], data_5_[11], data_5_[10], data_5_[9], data_5_[8], data_5_[7], data_5_[6], data_5_[5], data_5_[4], data_5_[3], data_5_[2], data_5_[1], data_5_[0]};
  //   R6_input[15:0] = {data_6_[15], data_6_[14], data_6_[13], data_6_[12], data_6_[11], data_6_[10], data_6_[9], data_6_[8], data_6_[7], data_6_[6], data_6_[5], data_6_[4], data_6_[3], data_6_[2], data_6_[1], data_6_[0]};
  //   R7_input[15:0] = {data_7_[15], data_7_[14], data_7_[13], data_7_[12], data_7_[11], data_7_[10], data_7_[9], data_7_[8], data_7_[7], data_7_[6], data_7_[5], data_7_[4], data_7_[3], data_7_[2], data_7_[1], data_7_[0]};
  //   R8_input[15:0] = {data_8_[15], data_8_[14], data_8_[13], data_8_[12], data_8_[11], data_8_[10], data_8_[9], data_8_[8], data_8_[7], data_8_[6], data_8_[5], data_8_[4], data_8_[3], data_8_[2], data_8_[1], data_8_[0]};
  //   R9_input[15:0] = {data_9_[15], data_9_[14], data_9_[13], data_9_[12], data_9_[11], data_9_[10], data_9_[9], data_9_[8], data_9_[7], data_9_[6], data_9_[5], data_9_[4], data_9_[3], data_9_[2], data_9_[1], data_9_[0]};
  //   R10_input[15:0] = {data_10_[15], data_10_[14], data_10_[13], data_10_[12], data_10_[11], data_10_[10], data_10_[9], data_10_[8], data_10_[7], data_10_[6], data_10_[5], data_10_[4], data_10_[3], data_10_[2], data_10_[1], data_10_[0]};
  //   R11_input[15:0] = {data_11_[15], data_11_[14], data_11_[13], data_11_[12], data_11_[11], data_11_[10], data_11_[9], data_11_[8], data_11_[7], data_11_[6], data_11_[5], data_11_[4], data_11_[3], data_11_[2], data_11_[1], data_11_[0]};
  //   R12_input[15:0] = {data_12_[15], data_12_[14], data_12_[13], data_12_[12], data_12_[11], data_12_[10], data_12_[9], data_12_[8], data_12_[7], data_12_[6], data_12_[5], data_12_[4], data_12_[3], data_12_[2], data_12_[1], data_12_[0]};
  //   R13_input[15:0] = {data_13_[15], data_13_[14], data_13_[13], data_13_[12], data_13_[11], data_13_[10], data_13_[9], data_13_[8], data_13_[7], data_13_[6], data_13_[5], data_13_[4], data_13_[3], data_13_[2], data_13_[1], data_13_[0]};
  //   R14_input[15:0] = {data_14_[15], data_14_[14], data_14_[13], data_14_[12], data_14_[11], data_14_[10], data_14_[9], data_14_[8], data_14_[7], data_14_[6], data_14_[5], data_14_[4], data_14_[3], data_14_[2], data_14_[1], data_14_[0]};
  //   R15_input[15:0] = {data_15_[15], data_15_[14], data_15_[13], data_15_[12], data_15_[11], data_15_[10], data_15_[9], data_15_[8], data_15_[7], data_15_[6], data_15_[5], data_15_[4], data_15_[3], data_15_[2], data_15_[1], data_15_[0]}
endmodule
